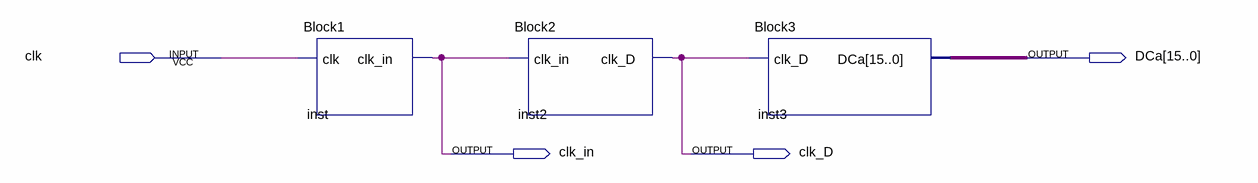
[diagram p0: schematic sheet]
// Quartus schematic Lab2.bdf as structural Verilog: 3 symbols, 4 pins
module Lab2 (
  input  clk,
  output [15:0] DCa,
  output clk_in,
  output clk_D
);

  Block1 inst (.clk(clk), .clk_in(clk_in));
  Block2 inst2 (.clk_in(clk_in), .clk_D(clk_D));
  Block3 inst3 (.clk_D(clk_D), .DCa(DCa));
endmodule
